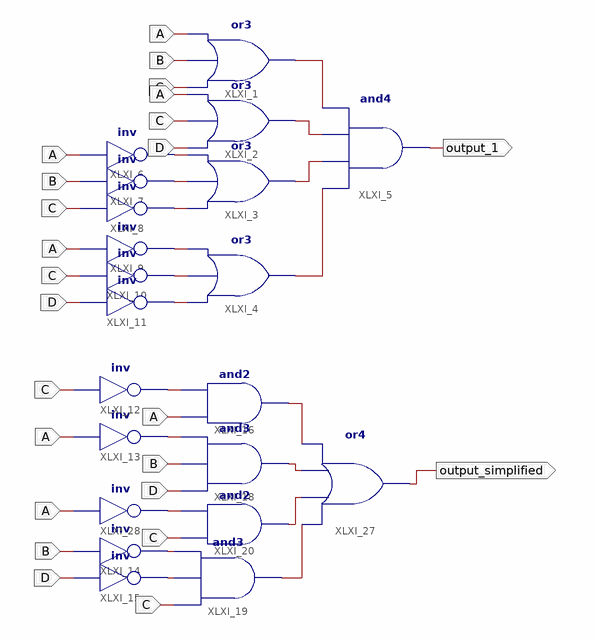
[diagram p0: schematic sheet 1]
// Xilinx ISE schematic problem_2_2.sch (spartan3e) as structural Verilog: 21 symbols, 6 ports
module problem_2_2 (
  input  A,
  input  B,
  input  C,
  input  D,
  output output_1,
  output output_simplified
);

  wire XLXN_1, XLXN_2, XLXN_3, XLXN_5, XLXN_6, XLXN_7, XLXN_21, XLXN_22, XLXN_23, XLXN_24, XLXN_25, XLXN_26,
       XLXN_27, XLXN_33, XLXN_34, XLXN_35, XLXN_36, XLXN_37, XLXN_38;

  or XLXI_1 (XLXN_21, C, B, A);
  or XLXI_2 (XLXN_22, D, C, A);
  or XLXI_3 (XLXN_23, XLXN_3, XLXN_2, XLXN_1);
  or XLXI_4 (XLXN_24, XLXN_7, XLXN_6, XLXN_5);
  and XLXI_5 (output_1, XLXN_24, XLXN_23, XLXN_22, XLXN_21);
  not XLXI_6 (XLXN_1, A);
  not XLXI_7 (XLXN_2, B);
  not XLXI_8 (XLXN_3, C);
  not XLXI_9 (XLXN_5, A);
  not XLXI_10 (XLXN_6, C);
  not XLXI_11 (XLXN_7, D);
  and XLXI_16 (XLXN_34, A, XLXN_25);
  and XLXI_19 (XLXN_37, C, XLXN_27, XLXN_33);
  and XLXI_20 (XLXN_36, C, XLXN_38);
  not XLXI_13 (XLXN_26, A);
  and XLXI_18 (XLXN_35, D, B, XLXN_26);
  or XLXI_27 (output_simplified, XLXN_37, XLXN_36, XLXN_35, XLXN_34);
  not XLXI_12 (XLXN_25, C);
  not XLXI_14 (XLXN_33, B);
  not XLXI_15 (XLXN_27, D);
  not XLXI_28 (XLXN_38, A);
endmodule
